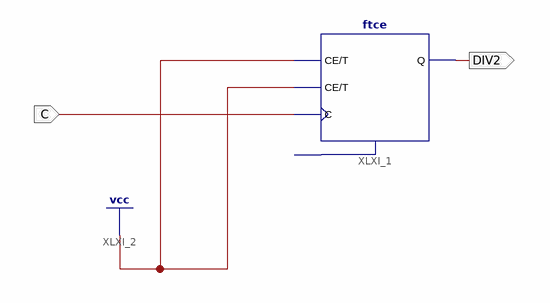
[diagram p0: schematic sheet 1]
// Xilinx ISE schematic Counter2.sch (spartan6) as structural Verilog: 1 symbols, 2 ports
module Counter2 (
  input  C,
  output DIV2
);

  ftce XLXI_1 (.C(C), .CE(1'b1), .T(1'b1), .Q(DIV2));  // open: CLR
endmodule
